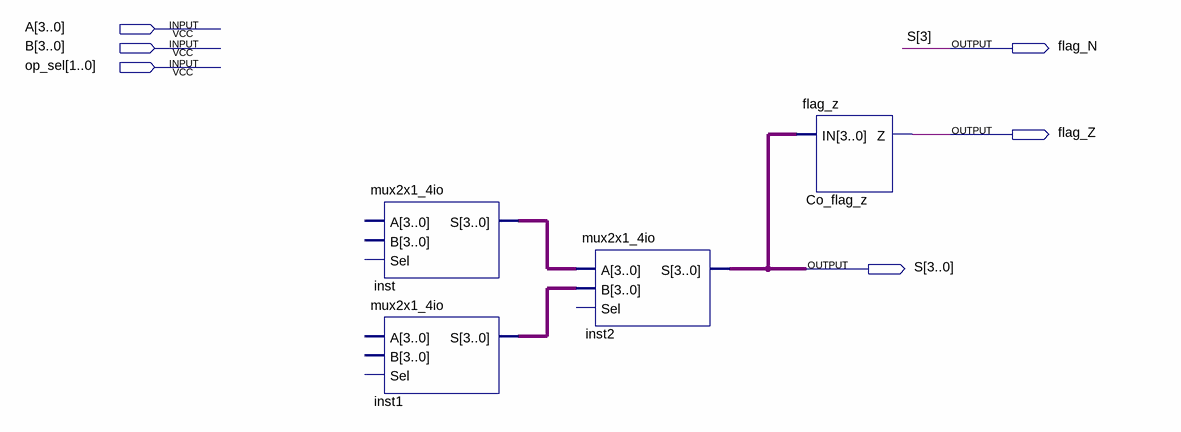
[diagram p0: schematic sheet]
// Quartus schematic ula.bdf as structural Verilog: 4 symbols, 6 pins
module ula (
  input  [3:0] A,
  input  [3:0] B,
  input  [1:0] op_sel,
  output flag_N,
  output flag_Z,
  output [3:0] S
);

  wire [3:0] inst1_s, inst_s;

  mux2x1_4io inst (.S(inst_s));  // open: A, B, Sel
  mux2x1_4io inst1 (.S(inst1_s));  // open: A, B, Sel
  mux2x1_4io inst2 (.A(inst_s), .B(inst1_s), .S({flag_N, S[2:0]}));  // open: Sel
  flag_z Co_flag_z (.IN({flag_N, S[2:0]}), .Z(flag_Z));

  assign S[3] = flag_N;
endmodule
